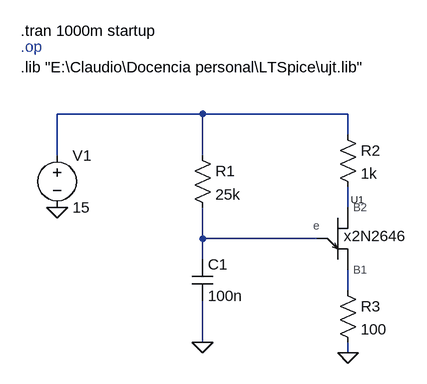
[diagram p0: schematic osc res neg ujt.asc]
osc res neg ujt.asc, the LTspice schematic file:
Version 4
SHEET 1 1588 1236
WIRE 416 48 192 48
WIRE 640 48 416 48
WIRE 640 80 640 48
WIRE 192 112 192 48
WIRE 416 112 416 48
WIRE 640 192 640 160
WIRE 416 240 416 192
WIRE 592 240 416 240
WIRE 416 272 416 240
WIRE 640 320 640 288
WIRE 416 400 416 336
WIRE 640 416 640 400
FLAG 192 192 0
FLAG 640 416 0
FLAG 416 400 0
DATAFLAG 512 240 ""
SYMBOL voltage 192 96 R0
WINDOW 123 0 0 Left 0
WINDOW 39 0 0 Left 0
SYMATTR InstName V1
SYMATTR Value 15
SYMBOL nujt 624 240 R0
WINDOW 3 58 -4 Center 2
SYMATTR Value x2N2646
SYMATTR InstName U1
SYMBOL res 400 96 R0
SYMATTR InstName R1
SYMATTR Value 25k
SYMBOL res 624 64 R0
SYMATTR InstName R2
SYMATTR Value 1k
SYMBOL res 624 304 R0
SYMATTR InstName R3
SYMATTR Value 100
SYMBOL cap 400 272 R0
SYMATTR InstName C1
SYMATTR Value 100n
TEXT 136 -24 Left 2 !.lib "E:\\Claudio\\Docencia personal\\LTSpice\\ujt.lib"
TEXT 136 -56 Left 2 ;.op
TEXT 136 -80 Left 2 !.tran 1000m startup

The netlist it stands for:
* osc res neg ujt.asc
V1 N001 0 15
XU1 N003 N004 N002 x2N2646  ; pins e B1 B2
R1 N001 N003 25k
R2 N001 N002 1k
R3 N004 0 100
C1 N003 0 100n
.lib "E:\Claudio\Docencia personal\LTSpice\ujt.lib"
* .op
.tran 1000m startup
.backanno
.end